# Altium schematic sheet Sheet1.SCHDOC
size 209 x 297 mm; SheetTotal: 1; DocumentName: Sheet1.SCHDOC
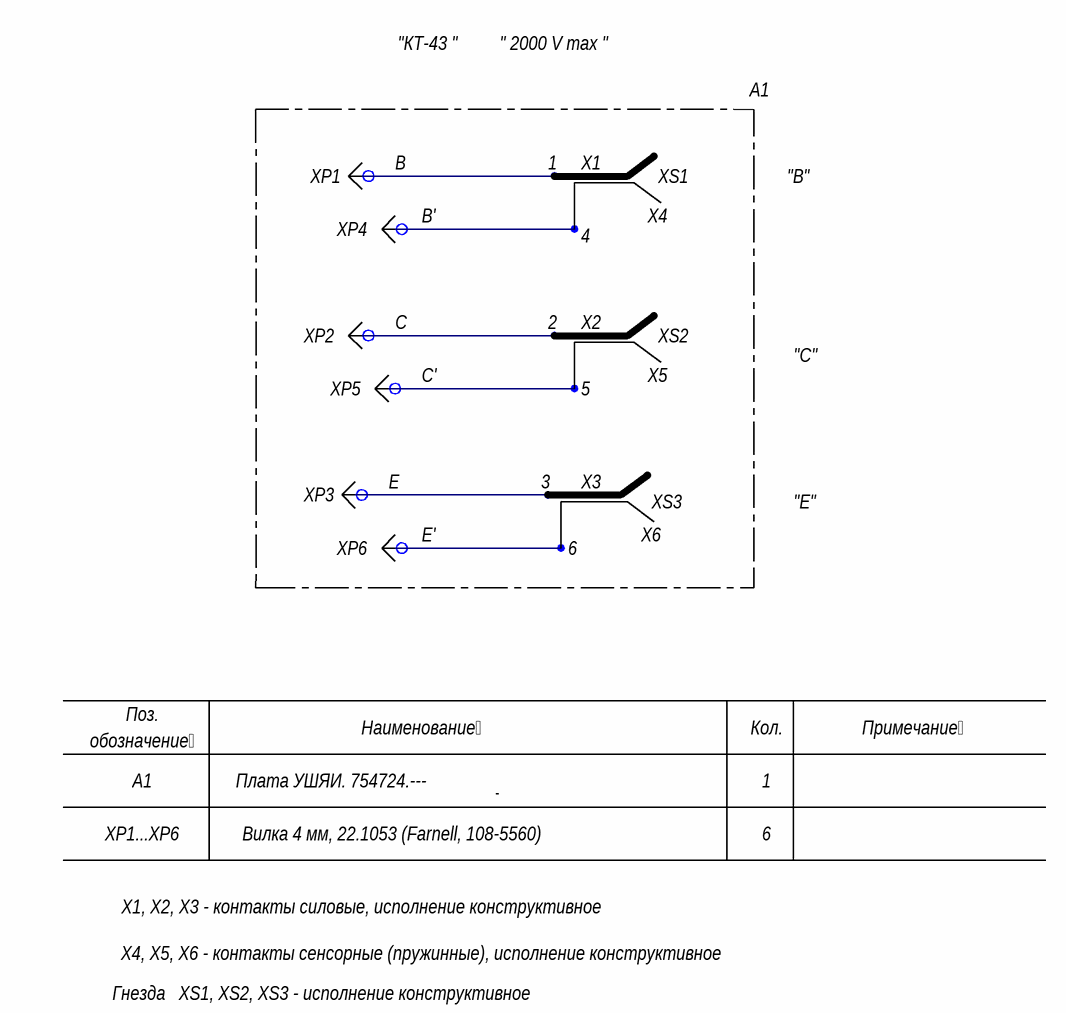
[diagram p0: Sheet1.SCHDOC]

## Parts
U1  XP (LEFT)  (value not drawn)
U5  XP (LEFT)  (value not drawn)
U7  XP (LEFT)  (value not drawn)
U9  XP (LEFT)  (value not drawn)
U15  XP (LEFT)  (value not drawn)
U16  XP (LEFT)  (value not drawn)
U207  POINT (VERY SMALL)  (value not drawn)
U208  POINT (VERY SMALL)  (value not drawn)
U209  POINT (VERY SMALL)  (value not drawn)
U214  POINT (VERY SMALL)  (value not drawn)
U215  POINT (VERY SMALL)  (value not drawn)
U216  POINT (VERY SMALL)  (value not drawn)

## Nets
NetU1_0: U1.0 U208.0
NetU5_0: U5.0 U209.0
NetU7_0: U7.0 U207.0
NetU9_0: U9.0 U215.0
NetU15_0: U15.0 U216.0
NetU16_0: U16.0 U214.0

## Notes on the sheet
- "КТ-43 "
- " 2000 V max "
- A1
- (near U1) XP1
- B
- (near U208) 1
- (near U208) Х1
- XS1
- "B"
- (near U5) XP4
- (near U5) B'
- (near U209) 4
- Х4
- (near U9) XP2
- C
- (near U215) 2
- (near U215) Х2
- XS2
- (near U7) XP5
- (near U7) C'
- (near U207) 5
- Х5
- "C"
- (near U15) XP3
- E
- (near U16) E'
- (near U216) 3
- (near U216) Х3
- Х6
- XS3
- "E"
- (near U16) XP6
- (near U214) 6
- обозначение
- Поз.
- Наименование
- Кол.
- Примечание
- Плата УШЯИ. 754724.---
- 1
- XP1...XP6
- Вилка 4 мм, 22.1053 (Farnell, 108-5560)
- 6
- Х1, Х2, Х3 - контакты силовые, исполнение конструктивное
- Гнезда   XS1, XS2, XS3 - исполнение конструктивное
- Х4, Х5, Х6 - контакты сенсорные (пружинные), исполнение конструктивное
- Перв. примен.
- Справ. №
- Подп. дата
- Инв. № дубл.
- Взам. инв. №
- Подп. и дата
- Изм.
- Разраб.
- Лист
- № докум.
- Подп.
- Дата
- Лит.
- Масса
- Масштаб
- Пров.
- Т.контр.
- Листов
- Инв. № подл.
- Н.контр.
- Утв.
- Файл:
- ALTIUM GOSTBOM2.0 KEV
- Копировал
- Формат А4

## Library data of the parts
U1 U5 U7 U9 U15 U16 = XP (LEFT): Value: *
U207-U209 U214-U216 = POINT (VERY SMALL): Value: *